# Altium schematic sheet bme_ads1299.SchDoc
size A4; DocumentNumber: 1; SheetNumber: 1; SheetTotal: 2
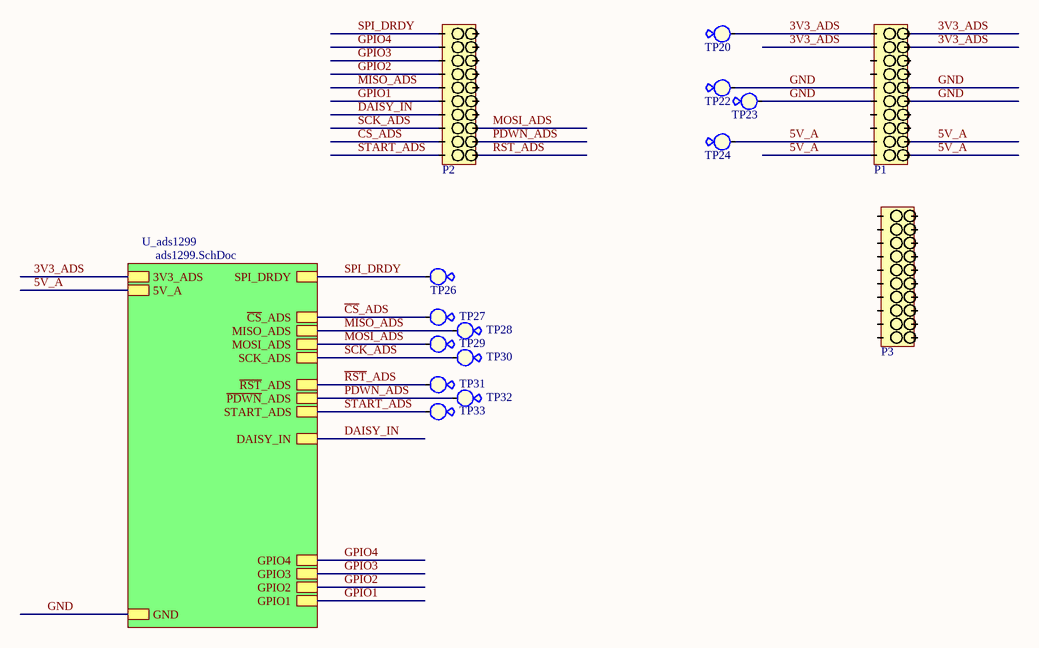
[diagram p0: bme_ads1299.SchDoc]

## Parts
P1  Mount Header (Male) 1.27mm  [M50-4301045]  (value not drawn)
P2  Mount Header (Male) 1.27mm  [M50-4301045]  (value not drawn)
P3  Mount Header (Male) 1.27mm  [M50-4301045]  (value not drawn)
TP20  Test Point  [testPoint]  (value not drawn)
TP22  Test Point  [testPoint]  (value not drawn)
TP23  Test Point  [testPoint]  (value not drawn)
TP24  Test Point  [testPoint]  (value not drawn)
TP26  Test Point  [testPoint]  (value not drawn)
TP27  Test Point  [testPoint]  (value not drawn)
TP28  Test Point  [testPoint]  (value not drawn)
TP29  Test Point  [testPoint]  (value not drawn)
TP30  Test Point  [testPoint]  (value not drawn)
TP31  Test Point  [testPoint]  (value not drawn)
TP32  Test Point  [testPoint]  (value not drawn)
TP33  Test Point  [testPoint]  (value not drawn)

## Sub-sheets
U_ads1299 = ads1299.SchDoc: GPIO4, GPIO2, GPIO3, START_ADS, GPIO1, DAISY_IN, 3V3_ADS, 5V_A, GND, SCK_ADS, MISO_ADS, MOSI_ADS, ~{CS}_ADS, ~{RST}_ADS, ~{PDWN}_ADS, SPI_DRDY

## Nets
3V3_ADS: P1.1 P1.2 P1.19 P1.20 TP20.0 ; sheet U_ads1299/3V3_ADS
5V_A: P1.9 P1.10 P1.11 P1.12 TP24.0 ; sheet U_ads1299/5V_A
~{CS}_ADS: P2.9 TP27.0 ; sheet U_ads1299/~{CS}_ADS
DAISY_IN: P2.7 ; sheet U_ads1299/DAISY_IN
GND: P1.5 P1.6 P1.15 P1.16 TP22.0 TP23.0 ; sheet U_ads1299/GND
GPIO1: P2.6 ; sheet U_ads1299/GPIO1
GPIO2: P2.4 ; sheet U_ads1299/GPIO2
GPIO3: P2.3 ; sheet U_ads1299/GPIO3
GPIO4: P2.2 ; sheet U_ads1299/GPIO4
MISO_ADS: P2.5 TP28.0 ; sheet U_ads1299/MISO_ADS
MOSI_ADS: P2.13 TP29.0 ; sheet U_ads1299/MOSI_ADS
~{PDWN}_ADS: P2.12 TP32.0 ; sheet U_ads1299/~{PDWN}_ADS
~{RST}_ADS: P2.11 TP31.0 ; sheet U_ads1299/~{RST}_ADS
SCK_ADS: P2.8 TP30.0 ; sheet U_ads1299/SCK_ADS
SPI_DRDY: P2.1 TP26.0 ; sheet U_ads1299/SPI_DRDY
START_ADS: P2.10 TP33.0 ; sheet U_ads1299/START_ADS

Not connected (* = marked no-connect by the designer): P1 3 4 7 8 13 14 17 18; P2 14 15 16 17 18 19 20; P3 1 2 3 4 5 6 7 8 9 10 11 12 13 14 15 16 17 18 19 20

## Library data of the parts
P1-P3 = 2x10 Mount Header (Male) 1.27mm: 2x10 Mount Header (Male); Value: 2x10 Mount Header, 1.27mm; Farnell: 1099531; Supplier: Krille har
TP20 TP22-TP24 TP26-TP33 = Test Point: Value: Test point; Farnell: 1702006